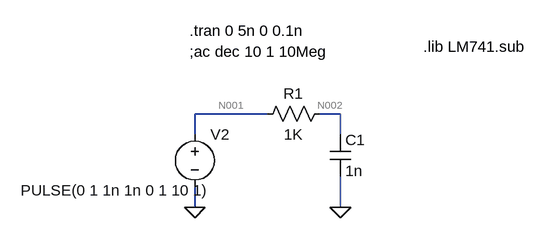
[diagram p0: schematic Draft1.asc]
Draft1.asc, the LTspice schematic file:
Version 4
SHEET 1 880 680
WIRE 128 64 16 64
WIRE 240 64 208 64
WIRE 16 96 16 64
WIRE 240 96 240 64
WIRE 16 208 16 176
WIRE 240 208 240 160
FLAG 16 208 0
FLAG 240 208 0
SYMBOL res 224 48 R90
WINDOW 0 0 56 VBottom 2
WINDOW 3 32 56 VTop 2
SYMATTR InstName R1
SYMATTR Value 1K
SYMBOL cap 224 96 R0
SYMATTR InstName C1
SYMATTR Value 1n
SYMBOL voltage 16 80 R0
WINDOW 3 -268 102 Left 2
WINDOW 123 24 124 Left 2
WINDOW 39 0 0 Left 0
SYMATTR InstName V2
SYMATTR Value PULSE(0 1 1n 1n 0 1 10 1)
TEXT 8 -32 Left 2 !;ac dec 10 1 10Meg
TEXT 8 -64 Left 2 !.tran 0 5n 0 0.1n
TEXT 368 -40 Left 2 !.lib LM741.sub

The netlist it stands for:
* Draft1.asc
R1 N002 N001 1K
C1 N002 0 1n
V2 N001 0 PULSE(0 1 1n 1n 0 1 10 1)
;ac dec 10 1 10Meg
.tran 0 5n 0 0.1n
.lib LM741.sub
.backanno
.end

* Results of the author's LTspice run, read from the files saved beside the schematic
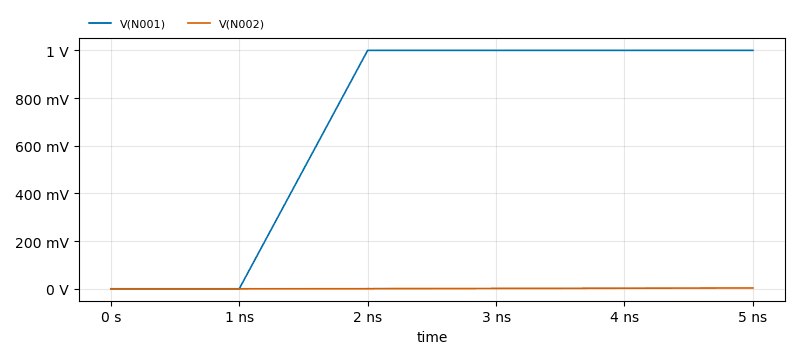
[diagram p1: Transient Analysis of Draft1.asc, plotted from the saved traces]
* Transient Analysis, 1 run:
*   V(N001): min 0 V, max 1 V, average 700 mV, rms 821.6 mV, last 1 V
*   V(N002): min 0 V, max 3.494 mV, average 1.236 mV, rms 1.926 mV, last 3.494 mV